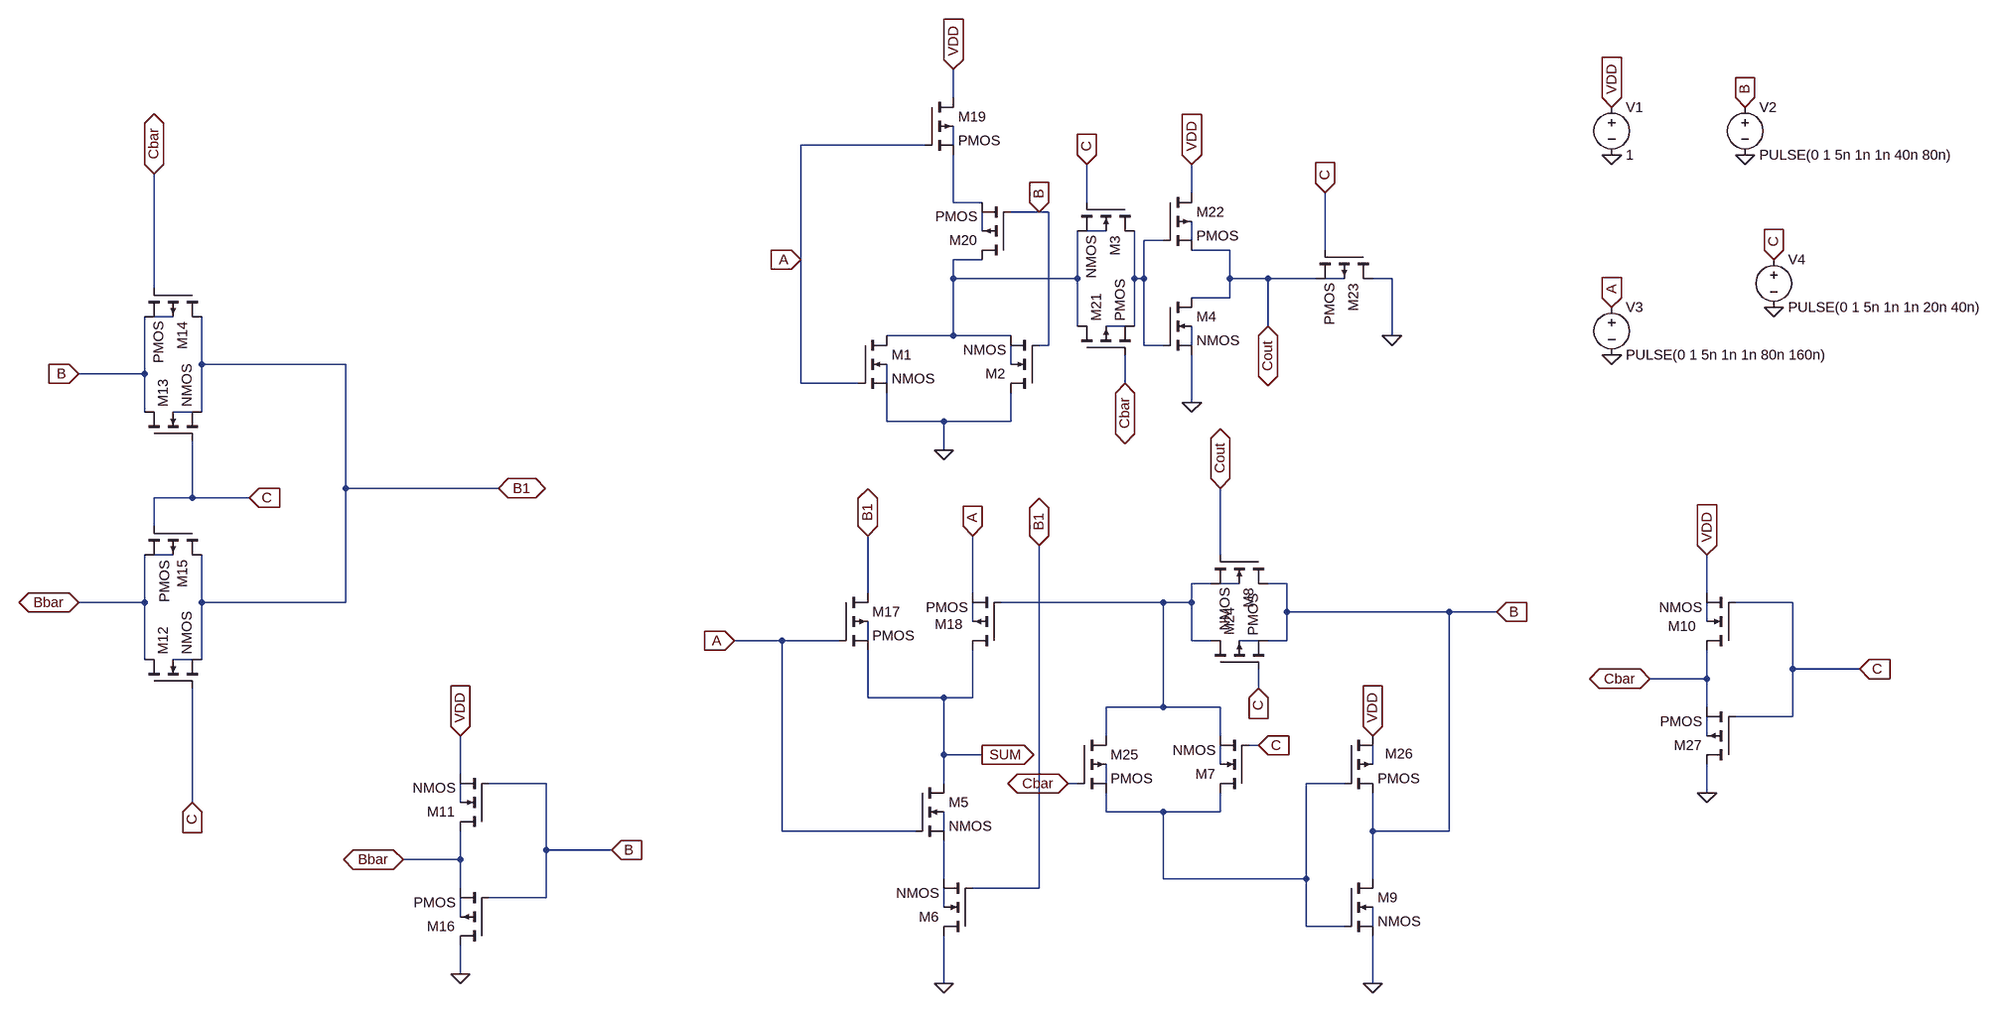
[diagram p0: schematic LTspice.asc]
LTspice.asc, the LTspice schematic file:
Version 4.1
SHEET 1 2464 1364
WIRE 128 -144 128 -192
WIRE 80 -64 -128 -64
WIRE 128 -64 128 -96
WIRE 528 16 528 -32
WIRE 128 32 128 -48
WIRE 176 32 128 32
WIRE 352 32 352 -32
WIRE 272 48 224 48
WIRE 288 48 272 48
WIRE 176 80 176 48
WIRE 384 80 352 80
WIRE 480 96 448 96
WIRE 528 96 528 64
WIRE 592 112 528 112
WIRE 752 112 752 16
WIRE -128 128 -128 -64
WIRE 176 128 128 128
WIRE 128 160 128 128
WIRE 336 160 336 80
WIRE 336 160 128 160
WIRE 432 160 432 80
WIRE 448 160 448 96
WIRE 448 160 432 160
WIRE 592 160 592 112
WIRE 656 160 592 160
WIRE 736 160 656 160
WIRE 784 160 752 160
WIRE 864 160 832 160
WIRE -1264 176 -1264 -16
WIRE 592 192 592 160
WIRE 592 192 528 192
WIRE -1232 224 -1264 224
WIRE 336 240 336 160
WIRE 416 240 384 240
WIRE 432 240 432 160
WIRE 656 240 656 160
WIRE 128 256 128 160
WIRE 128 256 16 256
WIRE 224 256 128 256
WIRE 864 256 864 160
WIRE 288 272 288 48
WIRE 288 272 272 272
WIRE 448 272 448 160
WIRE 480 272 448 272
WIRE 528 272 528 240
WIRE -1184 304 -1184 224
WIRE -912 304 -1184 304
WIRE 224 304 224 272
WIRE -1280 320 -1280 224
WIRE -1280 320 -1504 320
WIRE -128 336 -128 128
WIRE -32 336 -128 336
WIRE 16 336 16 304
WIRE 416 336 416 288
WIRE 528 368 528 288
WIRE -1280 384 -1280 320
WIRE -1200 384 -1232 384
WIRE -1184 384 -1184 304
WIRE 16 400 16 352
WIRE 112 400 16 400
WIRE 224 400 224 352
WIRE 224 400 112 400
WIRE 112 448 112 400
WIRE -912 512 -912 304
WIRE -656 512 -912 512
WIRE -1200 528 -1200 432
WIRE -1200 528 -1264 528
WIRE -1104 528 -1200 528
WIRE -1264 576 -1264 528
WIRE -1232 624 -1264 624
WIRE 576 624 576 512
WIRE 560 672 528 672
WIRE 608 672 576 672
WIRE 688 672 656 672
WIRE -16 688 -16 592
WIRE 160 688 160 592
WIRE 1408 688 1408 624
WIRE -1280 704 -1280 624
WIRE -1280 704 -1504 704
WIRE -1184 704 -1184 624
WIRE -912 704 -912 512
WIRE -912 704 -1184 704
WIRE 480 704 208 704
WIRE 528 704 528 672
WIRE 528 704 480 704
WIRE 1552 704 1456 704
WIRE 688 720 688 672
WIRE 960 720 688 720
WIRE 1040 720 960 720
WIRE 160 736 160 704
WIRE 1408 736 1408 704
WIRE -160 768 -240 768
WIRE -64 768 -160 768
WIRE -16 768 -16 736
WIRE 528 768 528 704
WIRE 560 768 528 768
WIRE 640 768 608 768
WIRE 688 768 688 720
WIRE 688 768 656 768
WIRE -1280 800 -1280 704
WIRE -1200 800 -1232 800
WIRE -1184 800 -1184 704
WIRE 1552 816 1552 704
WIRE 1664 816 1552 816
WIRE 1408 832 1408 784
WIRE 1408 832 1312 832
WIRE 640 848 640 816
WIRE -16 864 -16 784
WIRE 112 864 -16 864
WIRE 160 864 160 784
WIRE 160 864 112 864
WIRE 480 880 480 704
WIRE 480 880 384 880
WIRE 576 880 480 880
WIRE 1408 880 1408 832
WIRE 1552 896 1552 816
WIRE 1552 896 1456 896
WIRE 384 928 384 880
WIRE 576 928 576 880
WIRE 1408 928 1408 896
WIRE 640 944 624 944
WIRE 112 960 112 864
WIRE 176 960 112 960
WIRE 576 976 576 944
WIRE 832 976 832 944
WIRE -720 992 -720 928
WIRE -576 1008 -672 1008
WIRE 112 1008 112 960
WIRE 336 1008 320 1008
WIRE 384 1008 384 976
WIRE 784 1008 720 1008
WIRE 1408 1024 1408 976
WIRE -1200 1040 -1200 848
WIRE -720 1040 -720 1008
WIRE 384 1056 384 1024
WIRE 480 1056 384 1056
WIRE 576 1056 576 1024
WIRE 576 1056 480 1056
WIRE -160 1088 -160 768
WIRE 64 1088 -160 1088
WIRE 112 1088 112 1056
WIRE 832 1088 832 1024
WIRE 960 1088 960 720
WIRE 960 1088 832 1088
WIRE -576 1120 -576 1008
WIRE -464 1120 -576 1120
WIRE -720 1136 -720 1088
WIRE -720 1136 -816 1136
WIRE 112 1168 112 1104
WIRE 480 1168 480 1056
WIRE 720 1168 720 1008
WIRE 720 1168 480 1168
WIRE 832 1168 832 1088
WIRE -720 1184 -720 1136
WIRE 272 1184 272 608
WIRE 272 1184 160 1184
WIRE -576 1200 -576 1120
WIRE -576 1200 -672 1200
WIRE 112 1216 112 1184
WIRE -720 1232 -720 1200
WIRE 720 1248 720 1168
WIRE 784 1248 720 1248
WIRE 832 1248 832 1216
WIRE -720 1328 -720 1280
WIRE 112 1344 112 1264
WIRE 832 1344 832 1264
FLAG 112 448 0
FLAG 528 368 0
FLAG 864 256 0
FLAG 128 -192 VDD
IOPIN 128 -192 In
FLAG -128 128 A
IOPIN -128 128 In
FLAG 352 -32 C
IOPIN 352 -32 In
FLAG 416 336 Cbar
IOPIN 416 336 BiDir
FLAG 752 16 C
IOPIN 752 16 In
FLAG 528 -32 VDD
IOPIN 528 -32 In
FLAG 272 48 B
IOPIN 272 48 In
FLAG 1248 -48 0
FLAG 1248 -128 VDD
IOPIN 1248 -128 In
FLAG 656 240 Cout
IOPIN 656 240 BiDir
FLAG 1408 624 VDD
IOPIN 1408 624 In
FLAG 1408 1024 0
FLAG 832 928 VDD
IOPIN 832 928 In
FLAG 112 1344 0
FLAG 832 1344 0
FLAG 176 960 SUM
IOPIN 176 960 Out
FLAG -240 768 A
IOPIN -240 768 In
FLAG 160 592 A
IOPIN 160 592 In
FLAG 576 512 Cout
IOPIN 576 512 BiDir
FLAG -16 592 B1
IOPIN -16 592 BiDir
FLAG 272 608 B1
IOPIN 272 608 BiDir
FLAG 640 944 C
IOPIN 640 944 In
FLAG 640 848 C
IOPIN 640 848 In
FLAG 320 1008 Cbar
IOPIN 320 1008 BiDir
FLAG 1040 720 B
IOPIN 1040 720 In
FLAG -1504 320 B
IOPIN -1504 320 In
FLAG -1504 704 Bbar
IOPIN -1504 704 BiDir
FLAG -1200 1040 C
IOPIN -1200 1040 In
FLAG -1104 528 C
IOPIN -1104 528 In
FLAG -1264 -16 Cbar
IOPIN -1264 -16 BiDir
FLAG -656 512 B1
IOPIN -656 512 BiDir
FLAG 1664 816 C
IOPIN 1664 816 In
FLAG 1312 832 Cbar
IOPIN 1312 832 BiDir
FLAG -720 928 VDD
IOPIN -720 928 In
FLAG -720 1328 0
FLAG -464 1120 B
IOPIN -464 1120 In
FLAG -816 1136 Bbar
IOPIN -816 1136 BiDir
FLAG 1472 -48 0
FLAG 1472 -128 B
IOPIN 1472 -128 In
FLAG 1248 288 0
FLAG 1248 208 A
IOPIN 1248 208 In
FLAG 1520 208 0
FLAG 1520 128 C
IOPIN 1520 128 In
SYMBOL voltage 1248 -144 R0
WINDOW 123 0 0 Left 0
WINDOW 39 0 0 Left 0
SYMATTR InstName V1
SYMATTR Value 1
SYMBOL voltage 1472 -144 R0
WINDOW 123 0 0 Left 0
WINDOW 39 0 0 Left 0
SYMATTR InstName V2
SYMATTR Value PULSE(0 1 5n 1n 1n 40n 80n)
SYMBOL voltage 1248 192 R0
WINDOW 123 0 0 Left 0
WINDOW 39 0 0 Left 0
SYMATTR InstName V3
SYMATTR Value PULSE(0 1 5n 1n 1n 80n 160n)
SYMBOL voltage 1520 112 R0
WINDOW 123 0 0 Left 0
WINDOW 39 0 0 Left 0
SYMATTR InstName V4
SYMATTR Value PULSE(0 1 5n 1n 1n 20n 40n)
SYMBOL nmos4 -32 256 R0
SYMATTR InstName M1
SYMBOL nmos4 272 352 R180
SYMATTR InstName M2
SYMBOL nmos4 432 32 R90
SYMATTR InstName M3
SYMBOL nmos4 480 192 R0
SYMATTR InstName M4
SYMBOL nmos4 64 1008 R0
SYMATTR InstName M5
SYMBOL nmos4 160 1264 R180
SYMATTR InstName M6
SYMBOL nmos4 624 1024 R180
SYMATTR InstName M7
SYMBOL nmos4 656 624 R90
SYMATTR InstName M8
SYMBOL nmos4 784 1168 R0
SYMATTR InstName M9
SYMBOL nmos4 1456 784 R180
WINDOW 0 66 40 Left 2
SYMATTR InstName M10
SYMBOL nmos4 -672 1088 R180
SYMATTR InstName M11
SYMBOL nmos4 -1280 848 R270
SYMATTR InstName M12
SYMBOL nmos4 -1280 432 R270
SYMATTR InstName M13
SYMBOL pmos4 -1184 176 R90
SYMATTR InstName M14
SYMBOL pmos4 -1184 576 R90
WINDOW 3 58 62 Left 2
SYMATTR InstName M15
SYMBOL pmos4 -672 1280 R180
SYMATTR InstName M16
SYMBOL pmos4 -64 688 R0
SYMATTR InstName M17
SYMBOL pmos4 208 784 R180
WINDOW 0 64 43 Left 2
SYMATTR InstName M18
SYMBOL pmos4 80 -144 R0
SYMATTR InstName M19
SYMBOL pmos4 224 128 R180
SYMATTR InstName M20
SYMBOL pmos4 336 288 R270
SYMATTR InstName M21
SYMBOL pmos4 480 16 R0
SYMATTR InstName M22
SYMBOL pmos4 832 112 R90
SYMATTR InstName M23
SYMBOL pmos4 560 816 R270
SYMATTR InstName M24
SYMBOL pmos4 336 928 R0
SYMATTR InstName M25
SYMBOL pmos4 784 928 R0
WINDOW 0 69 30 Left 2
SYMATTR InstName M26
SYMBOL pmos4 1456 976 R180
SYMATTR InstName M27

The netlist it stands for:
* LTspice.asc
V1 VDD 0 1
V2 B 0 PULSE(0 1 5n 1n 1n 40n 80n)
V3 A 0 PULSE(0 1 5n 1n 1n 80n 160n)
V4 C 0 PULSE(0 1 5n 1n 1n 20n 40n)
M1 N007 A 0 N013 NMOS
M2 0 B N007 N012 NMOS
M3 N005 C N007 N004 NMOS
M4 Cout N005 0 N011 NMOS
M5 SUM A N030 N029 NMOS
M6 0 B1 N030 N031 NMOS
M7 N027 C N016 N024 NMOS
M8 B Cout N016 N017 NMOS
M9 B N027 0 N033 NMOS
M10 Cbar C VDD N019 NMOS
M11 Bbar B VDD N028 NMOS
M12 Bbar C B1 N022 NMOS
M13 B C B1 N014 NMOS
M14 B1 Cbar B N009 PMOS
M15 B1 C Bbar N015 PMOS
M16 0 B Bbar N032 PMOS
M17 B1 A SUM N020 PMOS
M18 SUM N016 A N018 PMOS
M19 VDD A N002 N001 PMOS
M20 N007 B N002 N003 PMOS
M21 N007 Cbar N005 N010 PMOS
M22 VDD N005 Cout N006 PMOS
M23 0 C Cout N008 PMOS
M24 N016 C B N021 PMOS
M25 N016 Cbar N027 N026 PMOS
M26 VDD N027 B N025 PMOS
M27 0 C Cbar N023 PMOS
.model NMOS NMOS
.model PMOS PMOS
.lib standard.mos
.backanno
.end